# Altium schematic sheet SD_Card.SchDoc: SD_Card
size Letter; DrawnBy: D. Fusi; DocumentNumber: 7; Revision: DVT; SheetNumber: 7; SheetTotal: 7
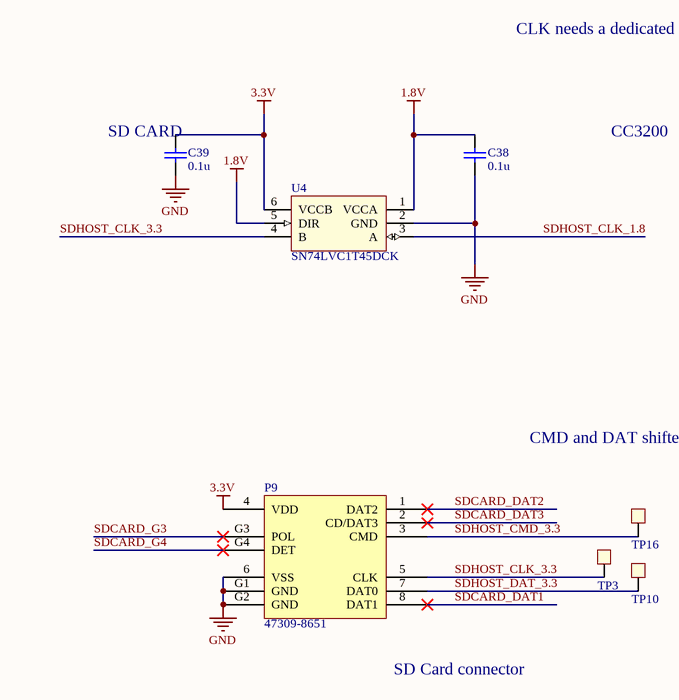
[diagram p0: SD_Card.SchDoc]

## Parts
C38  0.1u  [CAP0402_SENSE_DVT]
C39  0.1u  [CAP0402_SENSE_DVT]
P9  47309-8651  [molex_47309-8651]
TP3  TP  [TP-1.1]  (value not drawn)
TP10  TP  [TP-1.1]  (value not drawn)
TP16  TP  [TP-1.1]  (value not drawn)
U4  SN74LVC1T45DCK  [SC-70-6]

## Nets
1.8V: C38.2 U4.1(VCCA) U4.5(DIR)
3.3V: C39.2 P9.4(VDD) U4.6(VCCB)
GND: C38.1 C39.1 P9.6(VSS) P9.G1(GND) P9.G2(GND) U4.2(GND)
SDCARD_DAT1: P9.8(DAT1)
SDCARD_DAT2: P9.1(DAT2)
SDCARD_DAT3: P9.2(CD/DAT3)
SDCARD_G3: P9.G3(POL)
SDCARD_G4: P9.G4(DET)
SDHOST_CLK_1.8: U4.3(A)
SDHOST_CLK_3.3: P9.5(CLK) TP3.1 U4.4(B)
SDHOST_CMD_3.3: P9.3(CMD) TP16.1
SDHOST_DAT_3.3: P9.7(DAT0) TP10.1

## Notes on the sheet
- CLK needs a dedicated level shifter beacuse of speed
- SD CARD
- CC3200
- CMD and DAT shifter on dedicated level shifter
- SD Card connector
- TITLE
- DATE
- DRAWN BY
- REV
- SHEET
- OF

## Library data of the parts
C38 C39 = C_0.1u_10_50_X7R_0402: Chip capacitor; Vendor: Taiyo Yuden; PN: UMK105B7104KV-FR; Tolerance: 10%; Voltage: 50V; Temp: X7R; Hello_PN: 225-00468; Value: 0.1u; Size: 0402; item_category: Capacitor
P9 = molex_47309-8651: Molex SD card connector; Hello_PN: 280-00314; PN: 47309-8651; Vendor: Molex; item_category: Connector
TP3 TP10 TP16 = TP: testpoint
U4 = SN74LVC1T45DCK: Single-bit dual-supply bus transceiver; Vendor: TI; Hello_PN: 255-00324; item_category: IC_Digital; PN: SN74LVC1T45DCK